# EAGLE design teemsyUp (EAGLE 9.1.3)
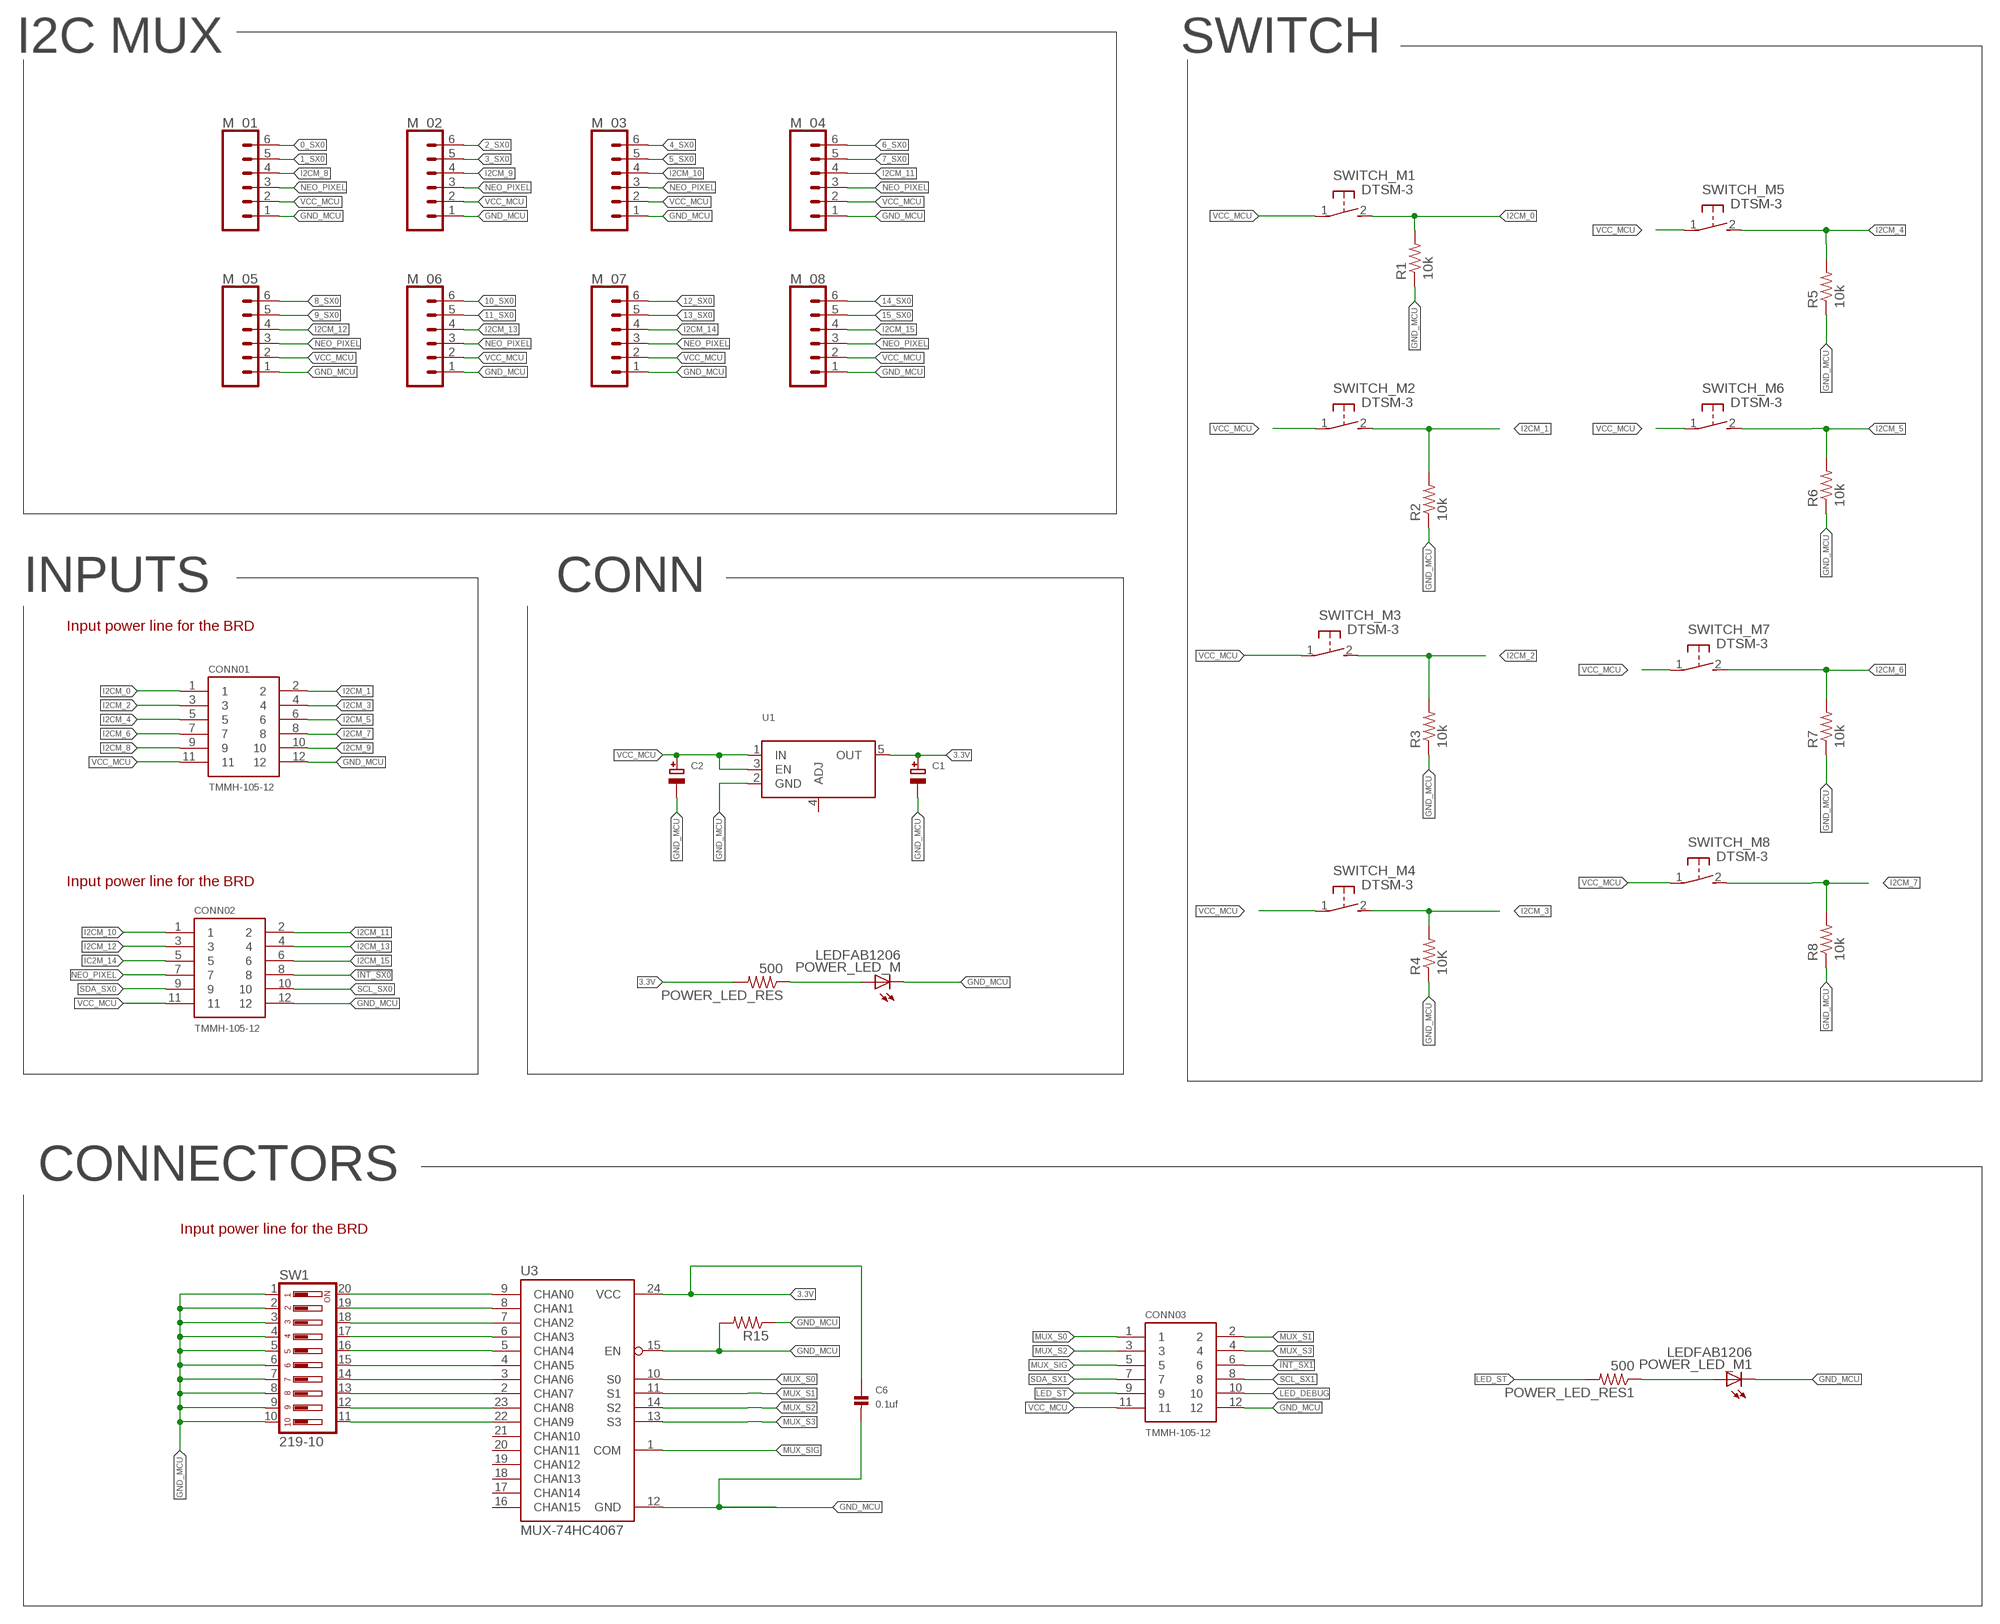
[diagram p0: schematic, sheet 1, part 1 of 2]
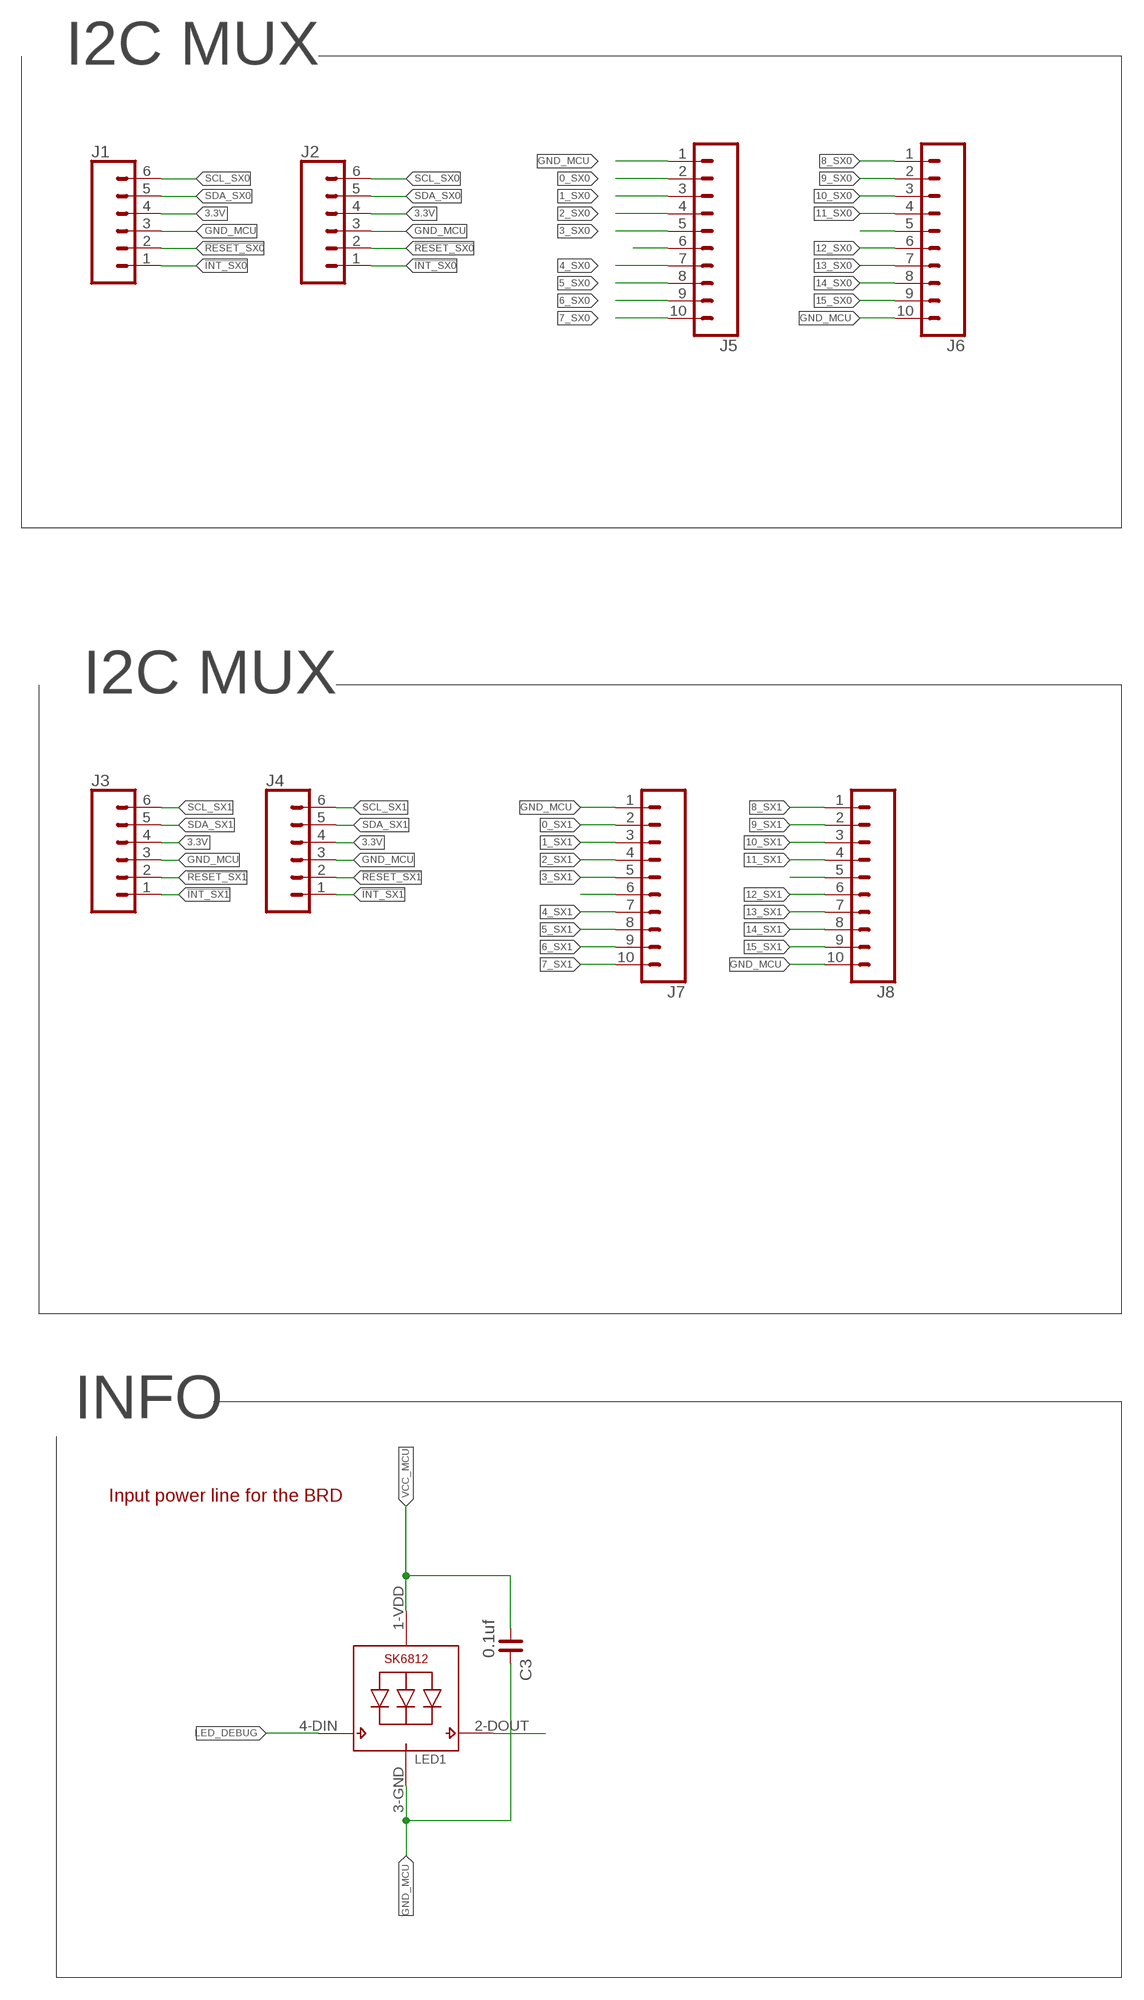
[diagram p1: schematic, sheet 1, part 2 of 2]

## Parts
C1  CAP_TANTALUMA/3216_REFLOW  [EIA3216-18/A-R]
C2  CAP_TANTALUMA/3216_REFLOW  [EIA3216-18/A-R]
C3  0.1uf  C_0805  [C0805]
C6  0.1uf  CAP_CERAMIC0805  [0805]
CONN01  TMMH-105-12  [TMMH-105-12]
CONN02  TMMH-105-12  [TMMH-105-12]
CONN03  TMMH-105-12  [TMMH-105-12]
J1  CONN_06SMD_MALE  [1X06_SMD_MALE]
J2  CONN_06SMD_MALE  [1X06_SMD_MALE]
J3  CONN_06SMD_MALE  [1X06_SMD_MALE]
J4  CONN_06SMD_MALE  [1X06_SMD_MALE]
J5  CONN_10SMD_MALE  [1X10_SMD_MALE]
J6  CONN_10SMD_MALE  [1X10_SMD_MALE]
J7  CONN_10SMD_MALE  [1X10_SMD_MALE]
J8  CONN_10SMD_MALE  [1X10_SMD_MALE]
LED1  SK6812_5050N  [LED5050_N]
M_01  CONN_06SMD-1MM  [1X06-1MM]
M_02  CONN_06SMD-1MM  [1X06-1MM]
M_03  CONN_06SMD-1MM  [1X06-1MM]
M_04  CONN_06SMD-1MM  [1X06-1MM]
M_05  CONN_06SMD-1MM  [1X06-1MM]
M_06  CONN_06SMD-1MM  [1X06-1MM]
M_07  CONN_06SMD-1MM  [1X06-1MM]
M_08  CONN_06SMD-1MM  [1X06-1MM]
POWER_LED_M  LEDFAB1206  [LED1206FAB]
POWER_LED_M1  LEDFAB1206  [LED1206FAB]
POWER_LED_RES  500  R-US_M0805  [M0805]
POWER_LED_RES1  500  R-US_R0805  [R0805]
R1  10k  R-US_M0805  [M0805]
R2  10k  R-US_M0805  [M0805]
R3  10k  R-US_M0805  [M0805]
R4  10K  R-US_M0805  [M0805]
R5  10k  R-US_M0805  [M0805]
R6  10k  R-US_M0805  [M0805]
R7  10k  R-US_M0805  [M0805]
R8  10k  R-US_M0805  [M0805]
R15  R-US_M0805  [M0805]
SW1  219-10  [CTS-219-10]
SWITCH_M1  DTSM-3  [DTSM-3]
SWITCH_M2  DTSM-3  [DTSM-3]
SWITCH_M3  DTSM-3  [DTSM-3]
SWITCH_M4  DTSM-3  [DTSM-3]
SWITCH_M5  DTSM-3  [DTSM-3]
SWITCH_M6  DTSM-3  [DTSM-3]
SWITCH_M7  DTSM-3  [DTSM-3]
SWITCH_M8  DTSM-3  [DTSM-3]
U1  ADP1712  [SOT23-5]
U3  MUX-74HC4067  MUX-74HC4067SMD  [SSOP24]

## Nets
0_SX0: J5.2 M_01.6
0_SX1: J7.2
1_SX0: J5.3 M_01.5
1_SX1: J7.3
2_SX0: J5.4 M_02.6
2_SX1: J7.4
3.3V: C1.+ C6.1 J1.4 J2.4 J3.4 J4.4 POWER_LED_RES.2 U1.5(OUT) U3.24(VCC)
3_SX0: J5.5 M_02.5
3_SX1: J7.5
4_SX0: J5.7 M_03.6
4_SX1: J7.7
5_SX0: J5.8 M_03.5
5_SX1: J7.8
6_SX0: J5.9 M_04.6
6_SX1: J7.9
7_SX0: J5.10 M_04.5
7_SX1: J7.10
8_SX0: J6.1 M_05.6
8_SX1: J8.1
9_SX0: J6.2 M_05.5
9_SX1: J8.2
10_SX0: J6.3 M_06.6
10_SX1: J8.3
11_SX0: J6.4 M_06.5
11_SX1: J8.4
12_SX0: J6.6 M_07.6
12_SX1: J8.6
13_SX0: J6.7 M_07.5
13_SX1: J8.7
14_SX0: J6.8 M_08.6
14_SX1: J8.8
15_SX0: J6.9 M_08.5
15_SX1: J8.9
!INT_SX0: CONN02.8 J1.1 J2.1
!INT_SX1: CONN03.6 J3.1 J4.1
!RESET_SX0: J1.2 J2.2
!RESET_SX1: J3.2 J4.2
C0: SW1.20 U3.9(CHAN0)
C1: SW1.19 U3.8(CHAN1)
C2: SW1.18 U3.7(CHAN2)
C3: SW1.17 U3.6(CHAN3)
C4: SW1.16 U3.5(CHAN4)
C5: SW1.15 U3.4(CHAN5)
C6: SW1.14 U3.3(CHAN6)
C7: SW1.13 U3.2(CHAN7)
C8: SW1.12 U3.23(CHAN8)
C9: SW1.11 U3.22(CHAN9)
GND_MCU: C1.- C2.- C3.2 C6.2 CONN01.12 CONN02.12 CONN03.12 J1.3 J2.3 J3.3 J4.3 J5.1 J6.10 J7.1 J8.10 LED1.3-GND(GND) M_01.1 M_02.1 M_03.1 M_04.1 M_05.1 M_06.1 M_07.1 M_08.1 POWER_LED_M1.2(C) POWER_LED_M.2(C) R1.1 R2.1 R3.1 R4.1 R5.1 R6.1 R7.1 R8.1 R15.1 R15.2 SW1.1 SW1.2 SW1.3 SW1.4 SW1.5 SW1.6 SW1.7 SW1.8 SW1.9 SW1.10 U1.2(GND) U3.12(GND) U3.15(EN)
I2CM_0: CONN01.1 R1.2 SWITCH_M1.2
I2CM_1: CONN01.2 R2.2 SWITCH_M2.2
I2CM_2: CONN01.3 R3.2 SWITCH_M3.2
I2CM_3: CONN01.4 R4.2 SWITCH_M4.2
I2CM_4: CONN01.5 R5.2 SWITCH_M5.2
I2CM_5: CONN01.6 R6.2 SWITCH_M6.2
I2CM_6: CONN01.7 R7.2 SWITCH_M7.2
I2CM_7: CONN01.8 R8.2 SWITCH_M8.2
I2CM_8: CONN01.9 M_01.4
I2CM_9: CONN01.10 M_02.4
I2CM_10: CONN02.1 M_03.4
I2CM_11: CONN02.2 M_04.4
I2CM_12: CONN02.3 M_05.4
I2CM_13: CONN02.4 M_06.4
I2CM_14: M_07.4
I2CM_15: CONN02.6 M_08.4
IC2M_14: CONN02.5
LED_DEBUG: CONN03.10 LED1.4-DIN(DI)
LED_ST: CONN03.9 POWER_LED_RES1.2
MUX_S0: CONN03.1 U3.10(S0)
MUX_S1: CONN03.2 U3.11(S1)
MUX_S2: CONN03.3 U3.14(S2)
MUX_S3: CONN03.4 U3.13(S3)
MUX_SIG: CONN03.5 U3.1(COM)
N$1: POWER_LED_M1.1(A) POWER_LED_RES1.1
N$11: POWER_LED_M.1(A) POWER_LED_RES.1
N$12: J5.6
N$13: LED1.2-DOUT(DO)
N$17: J7.6
N$18: J6.5
N$29: J8.5
NEO_PIXEL: CONN02.7 M_01.3 M_02.3 M_03.3 M_04.3 M_05.3 M_06.3 M_07.3 M_08.3
SCL_SX0: CONN02.10 J1.6 J2.6
SCL_SX1: CONN03.8 J3.6 J4.6
SDA_SX0: CONN02.9 J1.5 J2.5
SDA_SX1: CONN03.7 J3.5 J4.5
VCC_MCU: C2.+ C3.1 CONN01.11 CONN02.11 CONN03.11 LED1.1-VDD(VDD) M_01.2 M_02.2 M_03.2 M_04.2 M_05.2 M_06.2 M_07.2 M_08.2 SWITCH_M1.1 SWITCH_M2.1 SWITCH_M3.1 SWITCH_M4.1 SWITCH_M5.1 SWITCH_M6.1 SWITCH_M7.1 SWITCH_M8.1 U1.1(IN) U1.3(EN)
Unconnected: U1.4(ADJ) U3.16(CHAN15) U3.17(CHAN14) U3.18(CHAN13) U3.19(CHAN12) U3.20(CHAN11) U3.21(CHAN10)

## Notes on the sheet
- I2C MUX | SWITCH | I2C MUX
- I2C MUX
- INPUTS | CONN
- Input power line for the BRD
- Input power line for the BRD
- INFO
- CONNECTORS
- Input power line for the BRD
- Input power line for the BRD

## Library data of the parts
C1 C2 = microbuilder:CAP_TANTALUM: Tantalum Capacitors Wave footprints have larger pads and are meant to be used for hand soldering. Reflow footprints are optimised for solder paste and a reflow oven. EIA3216-18/A-[R/W] - Size A / 3216-18 / 1206 footprint 4.7µF 25V 10% Tantalum Capacitor 10µF 16V 10% Tantalum Capacitor [Digikey: 495-2236-2-ND] EIA3528-21/B-[R/W] - Size B / 3528-21 47µF 10V 10% Tantalum Capactior [Digikey: 495-2216-1-ND] EIA6032-28/C-[R/W] - Size C / 6032-28 10µF 35V 20% Tantalum Capacitor [Digikey: 495-2285-1-ND] 100µF 16V 10% Tantalum Capactior [Digikey: 399-5214-1-ND]
C3 = rc-master-smd:C_: NON-POLARIZED CAP
C6 = microbuilder:CAP_CERAMIC: Ceramic Capacitors 0402 - 0402 Surface Mount Capacitors 16pF 50V 5% [Digikey: 445-4899-2-ND] 18pF 50V 5% [Digikey: 490-1281-2-ND] 22pF 50V 5% [Digikey: 490-1283-2-ND] 68pF 50V 5% [Digikey: 490-1289-2-ND] 0.1uF 10V 10% [Digikey: 490-1318-2-ND] 1.0uF 6.3V 10% [Digikey: 490-1320-2-ND] 0603 - 0603 Surface Mount Capacitors 16 pF 50V 5% [Digikey: 445-5051-2-ND] 22 pF 50V [Digikey: PCC220ACVTR-ND] 33 pF 50V 5% [Digikey: 490-1415-1-ND] 56pF 50V 5% [Digikey: 490-1421-1-ND] 220pF 50V 5% [Digikey: 445-1285-1-ND] 680 pF 50V 2200 pF 50V 5% C0G [Digikey: 445-1297-1-ND] 5600 pF 100V 5% X7R [Digikey: 478-3711-1-ND] 0.1 µF 25V 10% [Digikey: PCC2277TR-ND] 0.22 µF 16V 10% X7R [Digikey: 445-1318-1-ND] 1.0 µF 25V 10% [Digikey: 445-5146-2-ND] 0603 - RF Specific 3pF 250V +/-0.1pF RF [Digikey: 712-1347-1-ND] 18 pF 250V 5% [Digikey: 478-3505-1-ND or 712-1322-1-ND] 56 pF 250V 5% C0G RF [Digikey: 490-4867-1-ND] 68 pF 250V RF [Digikey: 490-4868-1-ND] 0805 - 0805 Surface Mount Capacitors 220 pF 250V 2% RF Ceramic Capacitor [Digikey: 712-1398-1-ND] 1000 pF 50V 2% NP0 Ceramic Capacitor [Digikey: 478-3760-1-ND] 0.1 µF 25V 10% Ceramic Capacitor [Digikey: PCC1828TR-ND] 1.0 µF 16V 10% Ceramic Capacitor[Digikey: 490-1691-2-ND] 10.0 µF 10V 10% Ceramic Capacitor[Digikey: 709-1228-1-ND] 10.0 uF 16V 10% Ceramic Capacitor [Digikey: 478-5165-2-ND] 47 uF 6.3V 20% Ceramic Capacitor [Digikey: 587-1779-1-ND or 399-5506-1-ND] 1206 - 1206 Surface Mount Capacitors 47uF 10V 20% Ceramic Capacitor [Digikey: 490-5528-1-ND or 399-5508-1-ND or 445-6010-1-ND] 100uF 6.3V -20%, +80% Y5V Ceramic Capacitor (Digikey: 490-4512-1-ND, Mouser: 81-GRM31CF50J107ZE1L)
CONN01-CONN03 = TMMH-105-XX-XX-DV:TMMH-105-12: 2mm (.0787") Flex Shroud, .020" (.51mm) Square Post Terminal Strip, Surface Mount,10 Pins.
J1-J4 = SparkFun-Connectors:CONN_06: Multi connection point. Often used as Generic Header-pin footprint for 0.1 inch spaced/style header connections On any of the 0.1 inch spaced packages, you can populate with these: Break Away Headers - Straight <https://www.sparkfun.com/products/116> (PRT-00116) Break Away Male Headers - Right Angle <https://www.sparkfun.com/products/553> (PRT-00553) Female Headers <https://www.sparkfun.com/products/115> (PRT-00115) Break Away Headers - Machine Pin <https://www.sparkfun.com/products/117> (PRT-00117) Break Away Female Headers - Swiss Machine Pin <https://www.sparkfun.com/products/743> (PRT-00743) Arduino Stackable Header - 6 Pin <https://www.sparkfun.com/products/9280> (PRT-09280) For SCREWTERMINALS and SPRING TERMINALS visit here: Screw Terimnals on SparkFun.com <https://www.sparkfun.com/search/results?term=Screw+Terminals> (5mm/3.5mm/2.54mm spacing) This device is also useful as a general connection point to wire up your design to another part of your project. Our various solder wires solder well into these plated through hole pads. Hook-Up Wire - Assortment (Stranded, 22 AWG) <https://www.sparkfun.com/products/11375> (PRT-11375) Hook-Up Wire - Assortment (Solid Core, 22 AWG) <https://www.sparkfun.com/products/11367> (PRT-11367) View the entire wire category on our website here <https://www.sparkfun.com/categories/141>; PROD_ID: CONN-11293
J5-J8 = SparkFun-Connectors:CONN_10: Multi connection point. Often used as Generic Header-pin footprint for 0.1 inch spaced/style header connections On any of the 0.1 inch spaced packages, you can populate with these: Break Away Headers - Straight <https://www.sparkfun.com/products/116> (PRT-00116) Break Away Male Headers - Right Angle <https://www.sparkfun.com/products/553> (PRT-00553) Female Headers <https://www.sparkfun.com/products/115> (PRT-00115) Break Away Headers - Machine Pin <https://www.sparkfun.com/products/117> (PRT-00117) Break Away Female Headers - Swiss Machine Pin <https://www.sparkfun.com/products/743> (PRT-00743) Arduino Stackable Header - 10 Pin <https://www.sparkfun.com/products/11376> (PRT-11376) For SCREWTERMINALS and SPRING TERMINALS visit here: Screw Terimnals on SparkFun.com <https://www.sparkfun.com/search/results?term=Screw+Terminals> (5mm/3.5mm/2.54mm spacing) This device is also useful as a general connection point to wire up your design to another part of your project. Our various solder wires solder well into these plated through hole pads. Hook-Up Wire - Assortment (Stranded, 22 AWG) <https://www.sparkfun.com/products/11375> (PRT-11375) Hook-Up Wire - Assortment (Solid Core, 22 AWG) <https://www.sparkfun.com/products/11367> (PRT-11367) View the entire wire category on our website here <https://www.sparkfun.com/categories/141> Special notes: Molex polarized connector foot print use with SKU : PRT-08231 with associated crimp pins and housings. 1MM SMD Version SKU: PRT-10208 NOTES ON THE VARIANTS LOCK and LOCK_LONGPADS... This footprint was designed to help hold the alignment of a through-hole component (i.e. 6-pin header) while soldering it into place. You may notice that each hole has been shifted either up or down by 0.005 of an inch from it's more standard position (which is a perfectly straight line). This slight alteration caused the pins (the squares in the middle) to touch the edges of the holes. Because they are alternating, it causes a "brace" to hold the component in place. 0.005 has proven to be the perfect amount of "off-center" position when using our standard breakaway headers. Although looks a little odd when you look at the bare footprint, once you have a header in there, the alteration is very hard to notice. Also,if you push a header all the way into place, it is covered up entirely on the bottom side.; PROD_ID: CONN-11291
LED1 = SK6812:SK6812
M_01-M_08 = SparkFun-Connectors:CONN_06: Multi connection point. Often used as Generic Header-pin footprint for 0.1 inch spaced/style header connections On any of the 0.1 inch spaced packages, you can populate with these: Break Away Headers - Straight <https://www.sparkfun.com/products/116> (PRT-00116) Break Away Male Headers - Right Angle <https://www.sparkfun.com/products/553> (PRT-00553) Female Headers <https://www.sparkfun.com/products/115> (PRT-00115) Break Away Headers - Machine Pin <https://www.sparkfun.com/products/117> (PRT-00117) Break Away Female Headers - Swiss Machine Pin <https://www.sparkfun.com/products/743> (PRT-00743) Arduino Stackable Header - 6 Pin <https://www.sparkfun.com/products/9280> (PRT-09280) For SCREWTERMINALS and SPRING TERMINALS visit here: Screw Terimnals on SparkFun.com <https://www.sparkfun.com/search/results?term=Screw+Terminals> (5mm/3.5mm/2.54mm spacing) This device is also useful as a general connection point to wire up your design to another part of your project. Our various solder wires solder well into these plated through hole pads. Hook-Up Wire - Assortment (Stranded, 22 AWG) <https://www.sparkfun.com/products/11375> (PRT-11375) Hook-Up Wire - Assortment (Solid Core, 22 AWG) <https://www.sparkfun.com/products/11367> (PRT-11367) View the entire wire category on our website here <https://www.sparkfun.com/categories/141>; PROD_ID: CONN-08249; SF_ID: GPS-00579
POWER_LED_M POWER_LED_M1 = fab:LED: LED
POWER_LED_RES POWER_LED_RES1 R1-R8 R15 = resistor:R-US_: RESISTOR, American symbol
SW1 = switch-dil:219-10*: Surface Mount DIP Switch Series 219 SMT CTS Electronic Components Sourc: www.ctscorp.com; MF: SLI (CML/IDI); MPN: 219-10PK; OC_FARNELL: unknown; OC_NEWARK: 19M0224
SWITCH_M1-SWITCH_M8 = switch-tact:DTSM-3
U1 = microbuilder:ADP1712: LDO Adj. Voltage Regulator 300mA The ADP1712 voltage regulator is ideal for regulating battery or solar power due to it's very low foreward voltage drop (maximum 170mV at 300mA). Forward Voltage Dropout: 170mV at 300mA Input Voltage Range: 2.5V-5.5V Output Voltage Range: 0.8V-5.0V 1.2V - Digikey: ADP1712AUJZ-1.2-R7CT-ND 1.8V - Digikey: ADP1712AUJZ-1.8-R7CT-ND 3.3V - Digikey: ADP1712AUJZ-3.3-R7CT-ND
U3 = SparkFun:MUX-74HC4067

## Net classes
0 default: width 0.21 mm, clearance 0.12 mm

## Board
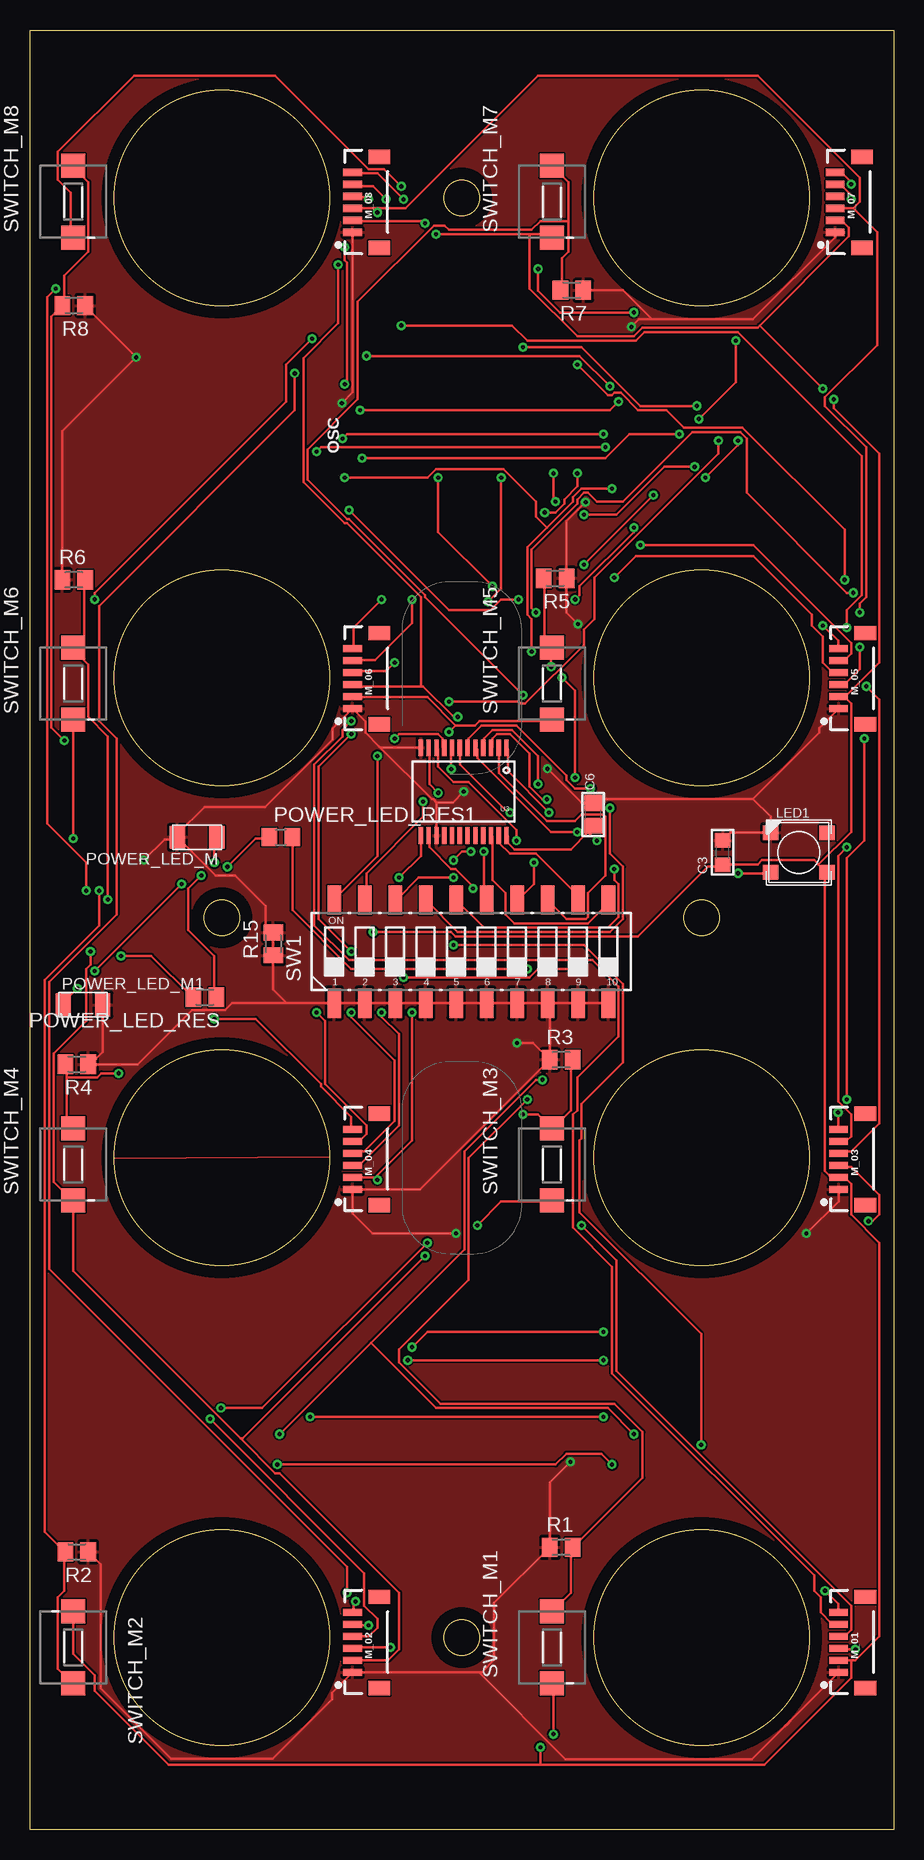
[diagram p2: board, top side]
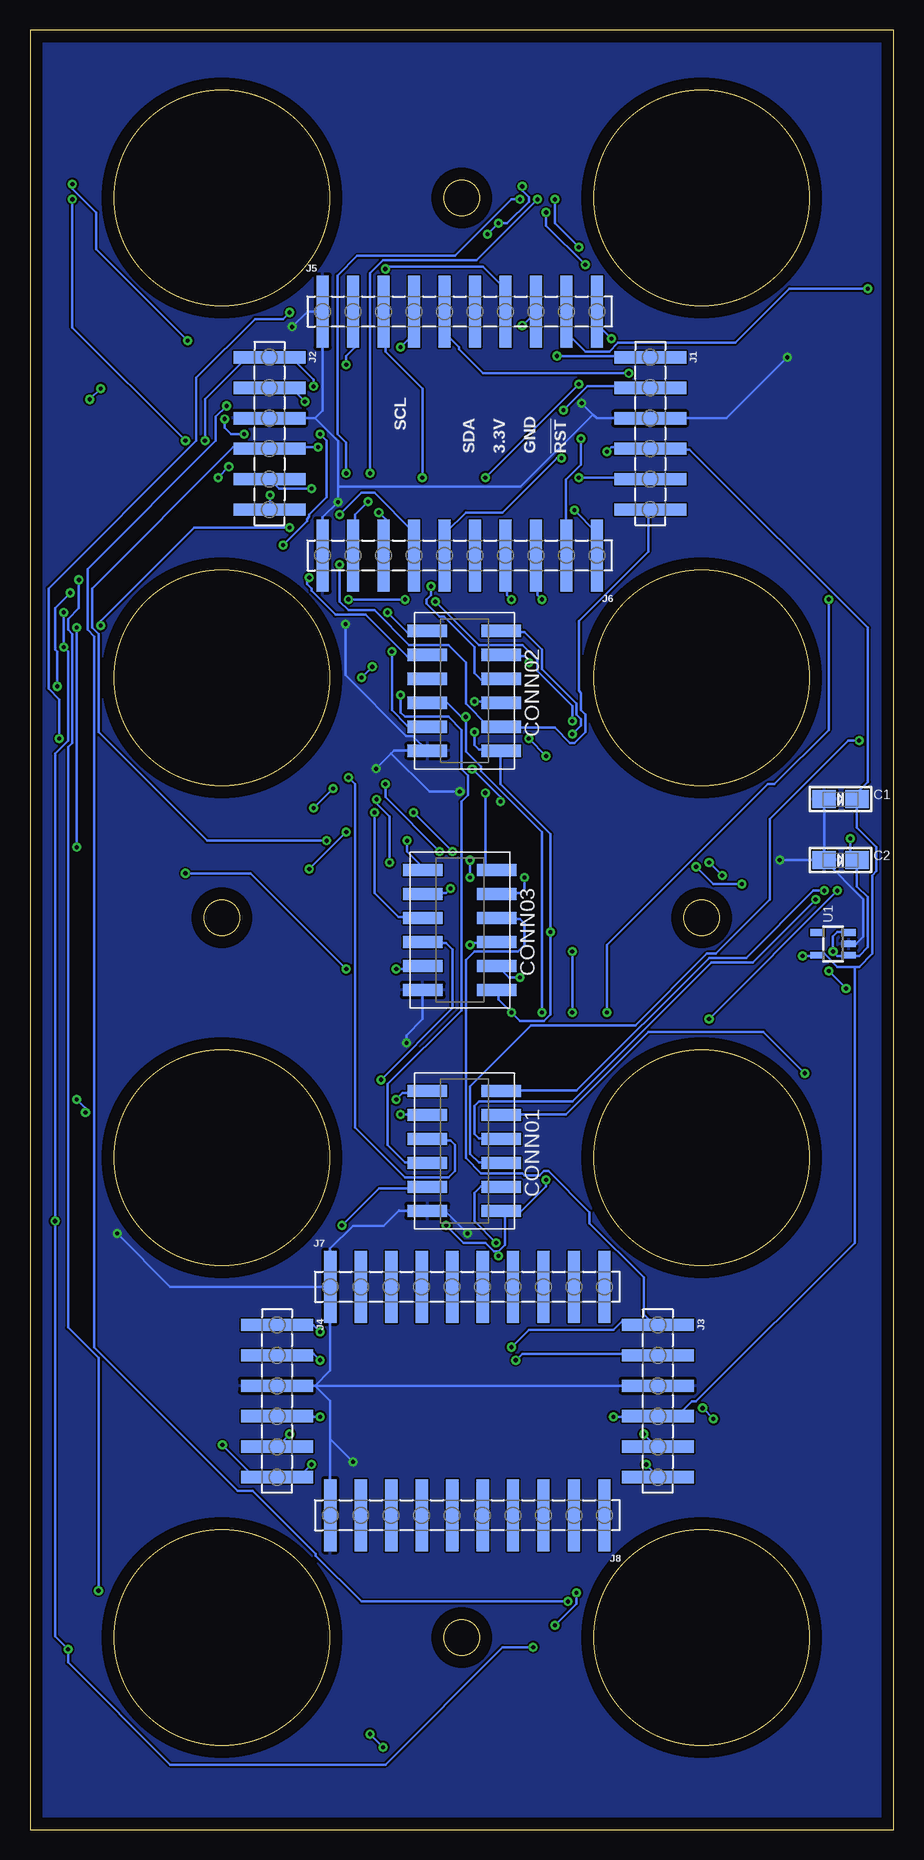
[diagram p3: board, bottom side, seen from below]

Size 72 x 150 mm. Coordinates in mm from the lower left corner, seen from the top.
Outline: 72,150 72,0 0,0 0,150 72,150
Outline: circle at 36,16 radius 1.5
Outline: circle at 16,76 radius 1.5
Outline: circle at 36,136 radius 1.5
Outline: circle at 56,76 radius 1.5
Outline: circle at 16,136 radius 9
Outline: circle at 56,136 radius 9
Outline: circle at 56,96 radius 9
Outline: circle at 56,56 radius 9
Outline: circle at 56,16 radius 9
Outline: circle at 16,16 radius 9
Outline: circle at 16,56 radius 9
Outline: circle at 16,96 radius 9
Copper layers (1*16): Top 0.035mm / dielectric 1.5mm / Bottom 0.035mm
Design rules "default": minimum track width 6mil, minimum drill 0.35mm, track to track 6mil, track to pad 6mil, pad to pad 6mil, via to via 6mil, smd to smd 6mil, copper to edge 40mil, drill to drill 6mil, minimum pad ring 10mil, minimum via ring 8mil, stop-mask expansion 4mil, vias tented up to drill 0mil, thermal gap 10mil

### Footprints (pad centres in the part's own frame; a part is rotated, then mirrored left to right if it is on the bottom)
EIA3216-18/A-R = smd 1.95 x 1.5: + 1.375,0; - -1.375,0
C0805 = smd 1.2 x 1.3: 1 -1.016,0; 2 1.016,0
0805 = smd 1.3 x 1.5: 1 -0.95,0; 2 0.95,0
TMMH-105-12 = smd 1.016 x 3.302: 1 -5.27,-3.086; 2 -5.27,3.086; 3 -3.27,-3.086; 4 -3.27,3.086; 5 -1.27,-3.086; 6 -1.27,3.086; 7 0.73,-3.086; 8 0.73,3.086; 9 2.73,-3.086; 10 2.73,3.086; 11 4.73,3.086; 12 4.73,-3.086
1X06_SMD_MALE = smd 1.02 x 6: 1 0,0; 2 2.54,0; 3 5.08,0; 4 7.62,0; 5 10.16,0; 6 12.7,0
1X10_SMD_MALE = smd 1.02 x 6: 1 0,0; 2 2.54,0; 3 5.08,0; 4 7.62,0; 5 10.16,0; 6 12.7,0; 7 15.24,0; 8 17.78,0; 9 20.32,0; 10 22.86,0
LED5050_N = smd 1.3 x 1.2: 1-VDD 2.35,-1.65; 2-DOUT 2.35,1.65; 3-GND -2.35,1.65; 4-DIN -2.35,-1.65
1X06-1MM = smd 0.6 x 1.55: 1 -2.54,1.27; 2 -1.54,1.27; 3 -0.54,1.27; 4 0.46,1.27; 5 1.46,1.27; 6 2.46,1.27 | smd 1.2 x 1.8: P$1 -3.84,-0.955; P$2 3.76,-0.955
LED1206FAB = smd 1.27 x 1.905: 1 -1.651,0; 2 1.651,0
M0805 = smd 1.3 x 1.6: 1 -0.95,0; 2 0.95,0
R0805 = smd 1.3 x 1.5: 1 -0.95,0; 2 0.95,0
CTS-219-10 = smd 1.13 x 2.44: 1 -11.43,-4.3; 2 -8.89,-4.3; 3 -6.35,-4.3; 4 -3.81,-4.3; 5 -1.27,-4.3; 6 1.27,-4.3; 7 3.81,-4.3; 8 6.35,-4.3; 9 8.89,-4.3; 10 11.43,-4.3; 11 11.43,4.3; 12 8.89,4.3; 13 6.35,4.3; 14 3.81,4.3; 15 1.27,4.3; 16 -1.27,4.3; 17 -3.81,4.3; 18 -6.35,4.3; 19 -8.89,4.3; 20 -11.43,4.3
DTSM-3 = smd 2 x 2: 1 -3,0; 2 3,0
SOT23-5 = smd 0.55 x 1.2: 1 -0.95,-1.3; 2 0,-1.3; 3 0.95,-1.3; 4 0.95,1.3; 5 -0.95,1.3
SSOP24 = smd 0.348 x 1.397: 1 -3.575,-3.656; 2 -2.925,-3.656; 3 -2.275,-3.656; 4 -1.625,-3.656; 5 -0.975,-3.656; 6 -0.325,-3.656; 7 0.325,-3.656; 8 0.975,-3.656; 9 1.625,-3.656; 10 2.275,-3.656; 11 2.925,-3.656; 12 3.575,-3.656; 13 3.575,3.656; 14 2.925,3.656; 15 2.275,3.656; 16 1.625,3.656; 17 0.975,3.656; 18 0.325,3.656; 19 -0.325,3.656; 20 -0.975,3.656; 21 -1.625,3.656; 22 -2.275,3.656; 23 -2.925,3.656; 24 -3.575,3.656

### Placement (x,y rotation side)
C1  4.42,85.88 0 bottom
C2  4.42,80.8 0 bottom
C3  57.75,81.44 90 top
C6  46.96,84.61 90 top
CONN01  35.78,56.29 270 bottom
CONN02  35.78,94.65 270 bottom
CONN03  36.16,74.71 270 bottom
J1  20.29,122.72 270 bottom
J2  52.04,122.72 270 bottom
J3  19.65,42.07 270 bottom
J4  51.41,42.07 270 bottom
J5  47.59,126.52 0 bottom
J6  24.73,106.2 180 bottom
J7  46.96,45.24 0 bottom
J8  24.1,26.2 180 bottom
LED1  64.11,81.44 0 top
M_01  68.69,15.64 90 top
M_02  28.16,15.64 90 top
M_03  68.69,55.9 90 top
M_04  28.16,55.9 90 top
M_05  68.69,95.97 90 top
M_06  28.16,95.97 90 top
M_07  68.41,135.67 90 top
M_08  28.16,135.67 90 top
POWER_LED_M  13.94,82.71 180 top
POWER_LED_M1  4.42,68.74 0 top
POWER_LED_RES  14.58,69.38 180 top
POWER_LED_RES1  20.92,82.71 0 top
R1  44.29,23.53 0 top
R2  3.91,23.15 180 top
R3  44.29,64.17 0 top
R4  3.91,63.79 180 top
R5  43.78,104.3 180 top
R6  3.65,104.17 0 top
R7  45.18,128.3 180 top
R8  3.65,127.03 180 top
R15  20.29,73.82 90 top
SW1  36.8,73.19 0 top
SWITCH_M1  43.53,15.19 90 top
SWITCH_M2  3.59,15.19 270 top
SWITCH_M3  43.53,55.45 90 top
SWITCH_M4  3.59,55.45 90 top
SWITCH_M5  43.53,95.52 90 top
SWITCH_M6  3.59,95.52 90 top
SWITCH_M7  43.53,135.67 90 top
SWITCH_M8  3.59,135.67 90 top
U1  5.05,73.82 90 bottom
U3  36.16,86.52 180 top

### Tracks (layer width: path | path; a pad name or v marks a point on that pad's centre or on a via)
0_SX0  (via drill 0.35)
  Top 0.21: v66.29,19.91 67.38,18.82 67.38,18.1 M_01.6 | v67.92,104.17 67.92,108.34 59.4,116.85 54.51,116.85 53.06,118.3 50.71,118.3 49.26,119.75 48.71,119.75 48.53,119.57 48.17,119.57 v45.63,122.11
  Bottom 0.21: v66.29,19.91 66.29,39.3 68.83,41.84 68.83,90.22 68.46,90.58 68.46,99.64 68.83,100 68.83,100.91 67.92,101.81 v67.92,104.17 | v45.63,122.11 45.63,122.83 44.91,123.56 44.91,126.46 J5.2
1_SX0  (via drill 0.35)
  Top 0.21: v26.79,92.39 26.06,91.67 26.06,91.12 23.71,88.77 23.71,75.36 26.61,72.46 46.9,72.46 49.07,70.28 49.07,66.12 45.63,62.67 45.63,59.96 45.27,59.59 45.27,50.17 48.53,46.91 48.53,38.03 65.38,21.18 65.38,19.91 65.93,19.37 65.93,18.1 66.83,17.19 67.38,17.19 M_01.5 | v38.2,102.36 39.29,103.44 v39.29,112.69
  Bottom 0.21: v26.79,92.39 26.79,93.66 29.69,96.56 29.69,97.46 30.95,98.73 34.58,98.73 v38.2,102.36 | v39.29,112.69 39.29,120.11 42.37,123.19 42.37,126.46 J5.3
2_SX0  (via drill 0.35)
  Top 0.21: v27.15,19 26.97,18.82 26.97,18.1 M_02.6 | v55.6,118.66 50.89,118.66 45.99,123.56 v41.1,123.56
  Bottom 0.21: v27.15,19 44.36,19 48.17,22.81 48.17,22.99 53.42,28.25 54.69,28.25 66.65,40.2 66.65,99.46 67.19,100 67.19,105.08 56.5,115.77 56.5,117.76 v55.6,118.66 | v41.1,123.56 40.02,124.64 40.02,126.46 J5.4
3.3V  (via drill 0.35)
  Top 0.21: 46.54,83.15 46.9,83.51 C6.1 46.54,83.15 | 46.54,83.15 45.09,81.7 40.38,81.7 39.83,82.24 39.83,82.79 U3.24 | v47.26,82.42 46.54,83.15 | v47.81,34.41 v23.34,34.41 | v7.58,72.82 10.12,72.82 13.56,69.38 POWER_LED_RES.2 | v47.99,115.22 24.25,115.22 v23.89,114.86
  Bottom 0.21: v47.26,82.42 57.23,82.42 66.29,91.48 66.29,99.64 66.83,100.18 66.83,103.44 55.05,115.22 52.16,115.22 J2.4 51.97,115.22 v47.99,115.22 | v23.34,34.41 19.72,34.41 J3.4 19.54,34.59 17.91,34.59 16.82,35.67 16.46,35.67 3.23,48.9 3.23,71.91 | v47.81,34.41 51.25,34.41 J4.4 | v7.58,72.82 6.49,72.82 U1.5 6.31,73 5.77,73 4.68,71.91 3.23,71.91 | 3.23,71.91 2.87,71.91 1.78,73 1.78,79.53 1.42,79.89 1.42,81.88 3.05,83.51 3.05,85.87 C1.+ 2.87,86.05 2.87,86.59 2.14,87.32 2.14,100.18 17,115.04 20.26,115.04 J1.4 20.45,115.22 23.53,115.22 v23.89,114.86
3_SX0  (via drill 0.35)
  Top 0.21: v28.24,17.01 26.97,17.01 M_02.5 | v26.42,19.73 26.42,21.9 1.6,46.73 1.6,70.65 7.22,76.26 7.22,90.94 5.77,92.39 5.77,101.99 22.08,118.3 v22.08,121.38
  Bottom 0.21: v28.24,17.01 26.42,18.82 v26.42,19.73 | v22.08,121.38 34.22,121.38 36.21,123.38 36.21,123.56 37.3,124.64 37.3,126.46 J5.5
4_SX0  (via drill 0.35)
  Top 0.21: v67.38,59.77 67.38,58.51 M_03.6 | v68.1,60.86 68.1,80.97 69.55,82.42 v69.55,90.94 | v50.34,126.46 44.18,126.46 42.37,128.27 v42.37,130.08
  Bottom 0.21: v67.38,59.77 67.38,60.14 v68.1,60.86 | v69.55,90.94 69.55,94.2 70.46,95.11 70.46,103.44 58.13,115.77 58.13,121.02 53.24,125.91 50.89,125.91 v50.34,126.46 | v42.37,130.08 42.19,130.26 34.22,130.26 32.41,128.45 32.41,126.64 J5.7
5_SX0  (via drill 0.35)
  Top 0.21: v68.1,81.88 67.38,81.16 67.38,60.68 68.46,59.59 68.46,57.78 68.1,57.42 67.56,57.42 M_03.5 | v68.1,100.18 68.1,101.63 69.37,102.9 69.37,114.5 59.04,124.83 51.25,124.83 50.52,124.1 41.46,124.1 40.2,125.37 v30.95,125.37
  Bottom 0.21: v68.1,100.18 v68.1,81.88 | v30.95,125.37 29.87,126.46 J5.8
6_SX0  (via drill 0.35)
  Top 0.21: v15.37,67.57 18.81,67.57 24.25,62.13 24.25,61.95 26.79,59.41 26.79,58.51 M_04.6 | v4.68,78.26 4.68,80.61 1.42,83.87 1.42,127.72 v2.14,128.45
  Bottom 0.21: v4.68,78.26 v15.37,67.57 | v2.14,128.45 8.67,128.45 13.2,123.92 22.98,123.92 23.71,123.19 25.7,123.19 27.15,124.64 27.15,126.46 J5.9
7_SX0  (via drill 0.35)
  Top 0.21: v23.89,68.11 24.61,67.38 24.61,62.13 28.06,58.69 28.06,57.96 27.51,57.42 26.97,57.42 M_04.5 | v5.41,102.54 5.41,103.08 21.35,119.03 21.35,122.11 v23.53,124.28
  Bottom 0.21: v23.89,68.11 23.89,73.73 10.48,87.14 9.94,87.14 5.41,91.67 v5.41,102.54 | v23.53,124.28 24.61,125.37 24.61,126.46 J5.10
8_SX0  (via drill 0.35)
  Top 0.21: v66.11,100.36 67.38,99.09 67.38,98.55 M_05.6 | v50.34,108.52 50.34,108.16 45.81,103.62 45.81,102.9 v45.45,102.54 | v40.74,102.54 39.29,102.54 38.38,101.63 34.94,101.63 v26.61,109.97
  Bottom 0.21: v66.11,100.36 66.11,100.73 58.32,108.52 v50.34,108.52 | v40.74,102.54 v45.45,102.54 | v26.61,109.97 24.79,108.16 24.79,106.34 J6.1
9_SX0  (via drill 0.35)
  Top 0.21: v50.89,107.07 60.31,107.07 68.46,98.91 68.46,98.01 67.92,97.46 67.56,97.46 M_05.5 | v47.81,116.31 26.42,116.31 v26.06,115.95
  Bottom 0.21: v50.89,107.07 48.89,109.06 48.89,109.24 48.71,109.42 48.71,109.6 47.26,111.05 47.26,115.77 v47.81,116.31 | v26.06,115.95 26.06,113.77 27.33,112.5 27.33,106.34 J6.2
10_SX0  (via drill 0.35)
  Top 0.21: v29.32,102.54 26.97,100.18 26.97,98.55 M_06.6
  Bottom 0.21: v29.32,102.54 29.69,102.9 29.69,106.16 J6.3
11_SX0  (via drill 0.35)
  Top 0.21: v31.86,102.54 31.86,100.55 28.78,97.46 26.97,97.46 M_06.5
  Bottom 0.21: v31.86,102.54 32.22,102.9 32.22,106.16 J6.4
12_SX0  (via drill 0.35)
  Top 0.21: v68.46,137.15 68.46,137.33 67.74,138.05 67.19,138.05 M_07.6 | v58.86,124.1 58.86,120.66 v55.78,117.58 | v54.15,116.31 49.98,116.31 47.99,114.32 v27.69,114.32
  Bottom 0.21: v68.46,137.15 68.46,136.78 66.47,134.79 66.47,131.71 v58.86,124.1 | v55.78,117.58 55.78,116.85 55.24,116.31 v54.15,116.31 | v27.69,114.32 28.06,114.32 32.59,109.79 35.67,109.79 37.3,108.16 37.3,106.34 J6.6
13_SX0  (via drill 0.35)
  Top 0.21: v68.46,135.88 68.46,136.24 67.74,136.97 67.19,136.97 M_07.5 | v59.04,115.77 59.04,115.4 v56.32,112.69 | v55.42,113.59 52.88,113.59 48.89,109.6 v46.18,109.6
  Bottom 0.21: v68.46,135.88 68.46,125.19 v59.04,115.77 | v55.42,113.59 v56.32,112.69 | v46.18,109.6 44.36,111.42 43.28,111.42 40.02,108.16 40.02,106.34 J6.7
14_SX0  (via drill 0.35)
  Top 0.21: v31.14,135.88 28.96,138.05 26.97,138.05 M_08.6 | v45.63,113.05 45.63,111.96 44.55,110.87 44.55,110.51 43.82,109.79 v42.91,109.79
  Bottom 0.21: v31.14,135.88 31.86,135.88 36.57,131.17 44.73,131.17 46.36,129.54 46.36,116.31 45.63,115.58 v45.63,113.05 | v42.91,109.79 42.37,109.24 42.37,106.34 J6.8
15_SX0  (via drill 0.35)
  Top 0.21: v29.69,135.88 28.6,136.97 26.97,136.97 M_08.5 | v43.64,113.05 43.64,110.87 v43.82,110.69
  Bottom 0.21: v29.69,135.88 34.76,130.81 42.55,130.81 43.64,129.72 v43.64,113.05 | v43.82,110.69 44.91,109.6 44.91,106.34 J6.9
!INT_SX0  (via drill 0.35)
  Top 0.21: v34.94,94.02 40.74,94.02 40.92,93.84 41.28,93.84 46.18,98.73 46.18,100 47.08,100.91 47.08,104.35 57.41,114.68 v57.41,115.77 | v28.06,122.83 45.81,122.83 v48.35,120.3
  Bottom 0.21: v34.94,94.02 32.77,94.02 CONN02.8 | v57.41,115.77 57.41,119.21 53.97,122.65 52.16,122.65 J2.1 51.97,122.65 50.16,122.65 48.35,120.84 v48.35,120.3 | v28.06,122.83 20.45,122.83 J1.1
!INT_SX1  (via drill 0.35)
  Top 0.21: v47.81,41.47 33.13,41.47 v31.86,40.2
  Bottom 0.21: 20.26,42.38 20.08,42.2 19.72,42.2 J3.1 20.26,42.38 | 20.26,42.38 20.81,42.92 20.81,46 25.34,50.53 25.34,51.44 28.78,54.88 29.14,54.88 29.51,54.52 30.77,54.52 30.95,54.7 34.4,54.7 35.67,55.97 35.67,72.46 34.94,73.18 31.32,73.18 30.77,73.73 30.77,75.54 31.14,75.9 32.95,75.9 CONN03.6 | v47.81,41.47 48.35,42.02 51.25,42.02 J4.1 | v31.86,40.2 30.41,41.65 23.34,41.65 22.62,42.38 20.26,42.38
!RESET_SX0  (via drill 0.35)
  Top 0.21: v27.51,118.3 48.35,118.3 v49.07,119.03
  Bottom 0.21: v27.51,118.3 25.52,120.3 20.45,120.3 J1.2 | v49.07,119.03 50.16,120.11 51.97,120.11 J2.2
!RESET_SX1  (via drill 0.35)
  Top 0.21: v47.81,39.12 v31.5,39.12
  Bottom 0.21: v31.5,39.12 30.95,39.66 19.72,39.66 J3.2 | v47.81,39.12 48.35,39.66 51.25,39.66 J4.2
C0  (via drill 0.35)
  Top 0.21: v30.41,90.94 30.77,91.3 34.04,91.3 34.4,90.94 34.4,90.22 U3.9 | v28.96,89.49 28.96,81.16 25.34,77.53 SW1.20
  Bottom 0.21: v28.96,89.49 v30.41,90.94
C1  (via drill 0.35)
  Top 0.21: v35.12,88.4 35.12,90.03 U3.8 | v32.77,85.69 32.77,84.42 28.06,79.71 28.06,77.53 SW1.19
  Bottom 0.21: v35.12,88.4 32.77,86.05 v32.77,85.69
C2  (via drill 0.35)
  Top 0.21: v40.02,84.78 39.83,84.78 35.85,88.77 35.85,90.03 U3.7 | v36.75,81.52 36.03,81.52 v35.3,80.79 | v35.3,79.34 32.41,79.34 30.59,77.53 SW1.18
  Bottom 0.21: v36.75,81.52 v40.02,84.78 | v35.3,79.34 v35.3,80.79
C3  (via drill 0.35)
  Top 0.21: v46.72,86.77 45.45,86.77 44.73,87.5 44.73,87.86 40.56,92.03 37.66,92.03 36.57,90.94 36.57,90.22 U3.6 | v48.35,85.14 48.35,81.34 49.44,80.25 49.44,75.9 48.35,74.81 35.67,74.81 33.13,77.35 SW1.17
  Bottom 0.21: v48.35,85.14 v46.72,86.77
C4  (via drill 0.35)
  Top 0.21: v45.63,83.15 43.46,83.15 37.3,89.31 37.3,90.03 U3.5 | v48.71,80.07 48.71,79.16 49.07,78.8 49.07,76.08 48.17,75.18 37.84,75.18 35.67,77.35 SW1.16
  Bottom 0.21: v48.71,80.07 v45.63,83.15
C5  (via drill 0.35)
  Top 0.21: v42.37,87.14 42.37,89.49 40.2,91.67 38.57,91.67 37.84,90.94 37.84,90.22 U3.4 | v37.84,81.52 37.84,77.71 38.02,77.53 SW1.15
  Bottom 0.21: v42.37,87.14 42.37,86.05 v37.84,81.52
C6  (via drill 0.35)
  Top 0.21: v43.1,85.87 42.73,85.87 41.65,86.95 41.65,89.67 40.02,91.3 38.93,91.3 38.57,90.94 38.57,90.22 U3.3 | v42.01,80.61 42.01,78.8 40.74,77.53 SW1.14
  Bottom 0.21: v43.1,85.87 43.1,85.5 42.01,84.42 v42.01,80.61
C7
  Top 0.21: U3.2 39.11,90.03 39.11,88.04 43.1,84.06 45.45,84.06 45.99,84.6 47.81,84.6 47.99,84.42 47.99,79.53 46.54,78.08 46.54,76.08 46.36,75.9 44.73,75.9 43.28,77.35 SW1.13
C8
  Top 0.21: U3.23 39.11,82.79 39.11,82.24 40.02,81.34 42.19,81.34 45.63,77.89 45.63,77.53 SW1.12
C9
  Top 0.21: U3.22 38.57,82.79 38.57,79.16 39.65,78.08 39.65,76.26 40.38,75.54 46.54,75.54 48.35,77.35 SW1.11
GND_MCU  (via drill 0.35)
  Top 0.2: 37.44,13.1 37.67,13.1 38.7,14.13 38.7,18.89 R1.1 43.34,28.93 v45.05,30.64 | 37.44,13.1 M_02.1 25.21,11.41 25.21,10.84 20.25,5.88 11.75,5.88 5.88,11.75 5.88,22.12 R2.1 | M_08.1 26.89,119.79 v26,118.91 | R8.1 4.6,126.97 v8.86,122.72 2.7,116.56 R6.1 | 12.48,82.52 14.7,80.3 15.46,79.53 17.11,79.53 19.65,76.99 19.65,75.41 R15.2 R15.1 20.29,70.01 21.41,68.88 21.56,68.88 | 12.48,82.52 POWER_LED_M.2 12.29,82.96 14.58,85.25 19.62,85.25 25.23,90.86 25.23,91.76 M_06.1 27.97,92.35 27.97,91.42 29.12,90.27 | 21.56,68.88 SW1.1 SW1.2 SW1.3 SW1.4 SW1.5 SW1.6 SW1.7 SW1.8 | SW1.8 SW1.9 SW1.10 | SW1.8 43.34,68.69 R3.1 | M_01.1 63.4,9.08 63.18,8.82 62.92,8.6 60.2,5.88 44.66,5.88 37.44,13.1 | v35.53,49.69 28.54,49.69 26.89,51.34 M_04.1 32.53,53.36 R3.1 | v64.74,49.69 67.42,52.37 M_03.1 | 29.12,90.27 29.21,90.18 U3.12 | M_05.1 65.81,91.81 65.81,91.45 60.27,85.91 | 60.27,85.91 60.25,85.88 47.27,85.88 C6.2 46.01,85.56 v43.15,88.42 | v45.69,100.49 44.73,101.44 R5.1 44.73,109.06 45.69,110.02 v46.32,110.65 | R7.1 49.43,128.3 51.85,125.88 52.04,125.88 | 52.04,125.88 60.28,125.88 67.14,132.73 M_07.1 | 52.04,125.88 50.76,125.88 v50.13,125.25 | 29.12,90.27 33.5,85.88 33.62,85.88 33.89,85.62 | 33.89,85.62 33.89,85.25 U3.15 | 33.89,85.62 35.27,85.62 v36.16,86.52 | v9.5,80.8 11.21,82.52 12.48,82.52 | 21.56,68.88 16.84,68.88 16.28,68.32 13.52,68.32 8.99,63.79 5.05,63.79 | 5.05,63.79 R4.1 | R3.1 41.95,65.56 v40.61,65.56 | 60.27,85.91 61.75,84.42 LED1.3-GND 58.39,83.09 C3.2 | POWER_LED_M1.2 6.07,64.8 5.05,63.79
  Bottom 0.2: v26,118.91 25.05,117.95 | 25.05,117.95 24.73,117.63 J1.3 13.94,117.63 v8.86,122.72 | v35.53,49.69 37.4,51.56 CONN01.12 41.21,51.56 41.24,51.59 42.52,50.32 45.05,50.32 46.96,48.42 J7.1 | J7.1 60.3,45.24 v64.74,49.69 | 46.96,32.54 46.96,35.72 48.23,36.99 | 46.96,32.54 J8.10 | J4.3 48.23,36.99 | J7.1 46.96,38.26 48.23,36.99 | v45.05,30.64 46.96,32.54 | v43.15,88.42 41.88,89.69 | 41.88,89.69 41.66,89.92 CONN02.12 40.11,91.16 40.63,91.16 45.69,96.22 v45.69,100.49 | J6.10 47.59,109.38 v46.32,110.65 46.32,111.92 | 46.32,111.92 46.32,115.73 48.23,117.63 | 48.23,117.63 J2.3 | 48.23,117.63 47.59,118.27 J5.1 48.87,126.52 v50.13,125.25 | 46.32,111.92 31.08,111.92 25.05,117.95 | 41.88,89.69 38.7,86.52 v36.16,86.52 | C1.- C2.- | C2.- 2.51,77.52 2.51,74.45 3.15,73.82 U1.2 | C2.- v9.5,80.8 | v40.61,65.56 40.61,66.2 39.25,67.56 CONN03.12 | J3.3 48.23,36.99
  pour Top: -20.98,163.35 83.16,163.35 83.16,-6.83 -20.98,-6.83
  pour Bottom: -4.48,153.19 74.27,153.19 74.27,-3.01 -4.48,-3.01
I2CM_0  (via drill 0.35)
  Top 0.21: SWITCH_M1.2 43.64,18.28 45.09,19.73 45.09,23.35 R1.2 45.27,23.54 51.07,29.33 51.07,33.14 48.71,35.49 34.22,35.49 30.77,38.94 30.77,40.02 36.57,45.82 36.57,55.97 v41.46,60.86
  Bottom 0.21: v41.46,60.86 40.92,61.41 38.93,61.41 CONN01.1
I2CM_1  (via drill 0.35)
  Top 0.21: SWITCH_M2.2 3.41,12.3 2.33,13.39 2.33,19.37 2.87,19.91 2.87,22.99 R2.2 2.87,23.17 1.24,24.8 1.24,70.83 5.77,75.36 v5.77,78.26
  Bottom 0.21: v5.77,78.26 6.67,78.26 12.29,72.64 15.37,72.64 26.42,61.59 32.59,61.59 CONN01.2
I2CM_2  (via drill 0.35)
  Top 0.21: R3.2 45.09,64.12 45.09,59.96 43.64,58.51 SWITCH_M3.2 43.46,58.51 42.37,59.59 v41.1,59.59
  Bottom 0.21: v41.1,59.59 38.93,59.59 CONN01.3
I2CM_3  (via drill 0.35)
  Top 0.21: 3.05,62.67 3.05,58.87 3.41,58.51 SWITCH_M4.2 | 3.05,62.67 3.05,63.76 R4.2 | v7.4,63.04 5.95,63.04 5.59,62.67 3.05,62.67
  Bottom 0.21: v7.4,63.04 10.84,66.48 20.45,66.48 27.33,59.59 32.59,59.59 CONN01.4
I2CM_4  (via drill 0.35)
  Top 0.21: R5.2 42.91,104.17 42.91,99.09 43.46,98.55 SWITCH_M5.2 43.46,98.37 v43.46,96.92 | v45.45,87.68 45.45,94.93 v44.36,96.02
  Bottom 0.21: v45.45,87.68 44.91,87.14 44.91,58.51 40.74,54.34 37.12,54.34 36.57,54.88 36.57,57.06 36.94,57.42 38.75,57.42 CONN01.5 | v43.46,96.92 v44.36,96.02
I2CM_5  (via drill 0.35)
  Top 0.21: R6.2 4.5,104.17 4.5,99.46 3.59,98.55 SWITCH_M6.2 3.59,98.37 4.86,97.1 4.86,92.75 6.49,91.12 v6.49,77.53
  Bottom 0.21: v6.49,77.53 11.75,72.28 15.19,72.28 26.79,60.68 34.58,60.68 34.94,60.32 34.94,57.96 34.58,57.6 32.77,57.6 CONN01.6
I2CM_6  (via drill 0.35)
  Top 0.21: 44.91,134.07 44.91,137.33 43.64,138.6 SWITCH_M7.2 | 44.91,134.07 44.91,131.53 44.36,130.99 44.36,128.45 R7.2 | v41.1,94.56 32.95,102.72 32.95,102.9 26.61,109.24 26.42,109.24 23.16,112.5 23.16,115.04 27.33,119.21 27.33,127.36 33.67,133.7 34.58,133.7 34.94,133.34 41.83,133.34 42.55,134.07 44.91,134.07
  Bottom 0.21: v41.1,94.56 41.1,93.12 40.74,92.75 37.12,92.75 36.03,91.67 36.03,88.4 35.48,87.86 35.48,86.23 36.03,85.69 36.03,68.29 42.19,62.13 42.19,57.06 40.74,55.61 38.93,55.61 CONN01.7
I2CM_7  (via drill 0.35)
  Top 0.21: SWITCH_M8.2 3.59,138.6 4.86,137.33 4.86,131.53 2.87,129.54 2.87,127.18 R8.2 2.69,127 1.78,126.09 1.78,91.85 v2.87,90.76
  Bottom 0.21: v2.87,90.76 3.78,90.76 10.3,84.24 10.3,77.53 14.83,73 15.55,73 21.53,67.02 30.23,67.02 35.3,61.95 35.3,56.33 34.58,55.61 32.77,55.61 CONN01.8
I2CM_8  (via drill 0.35)
  Top 0.21: v45.99,50.35 48.89,47.45 48.89,38.21 68.46,18.64 68.46,16.65 67.92,16.11 67.56,16.11 M_01.4
  Bottom 0.21: v45.99,50.35 42.91,53.43 38.93,53.43 CONN01.9
I2CM_9  (via drill 0.35)
  Top 0.21: v15.01,34.23 27.88,21.36 27.88,18.64 28.96,17.55 28.96,16.83 28.24,16.11 26.97,16.11 M_02.4 | v15.92,35.13 19.36,35.13 v33.13,48.9
  Bottom 0.21: v15.92,35.13 v15.01,34.23 | v33.13,48.9 34.94,50.71 34.94,53.07 34.4,53.61 32.77,53.61 CONN01.10
I2CM_10  (via drill 0.35)
  Top 0.21: v69.73,95.29 70.82,94.2 70.82,58.87 68.46,56.51 67.56,56.51 M_03.4 | v68.64,103.08 68.1,103.08 59.77,111.42 59.77,115.95 59.22,116.49 55.24,116.49 49.44,110.69 47.26,110.69 46.54,111.42 46.18,111.42 45.63,110.87 45.63,110.51 41.83,106.71 41.83,101.81 v42.19,101.45
  Bottom 0.21: v69.73,95.29 69.73,98.19 69.91,98.37 69.91,101.81 v68.64,103.08 | v42.19,101.45 40.56,99.82 38.93,99.82 CONN02.1
I2CM_11  (via drill 0.35)
  Top 0.21: v26.79,68.11 26.79,67.75 30.41,64.12 30.41,59.05 27.88,56.51 26.97,56.51 M_04.4 | v26.79,73.18 24.07,75.9 24.07,88.59 v26.79,91.3
  Bottom 0.21: v26.79,73.18 v26.79,68.11 | v26.79,91.3 26.06,92.03 26.06,92.57 26.42,92.93 26.42,93.84 29.32,96.74 29.32,98.37 30.77,99.82 32.59,99.82 CONN02.2
I2CM_12  (via drill 0.35)
  Top 0.21: v48.71,104.35 50.52,106.16 60.31,106.16 65.2,101.27 65.2,100.36 66.11,99.46 66.11,97.28 66.83,96.56 67.38,96.56 M_05.4
  Bottom 0.21: v48.71,104.35 48.89,104.17 48.89,103.81 48.53,103.44 48.53,103.26 46.54,101.27 44,101.27 40.56,97.83 38.93,97.83 CONN02.3
I2CM_13  (via drill 0.35)
  Top 0.21: v30.41,97.28 29.69,96.56 26.97,96.56 M_06.4
  Bottom 0.21: v30.41,97.28 30.41,97.46 30.77,97.83 32.59,97.83 CONN02.4
I2CM_15  (via drill 0.35)
  Top 0.21: v28.24,135.88 28.06,136.06 26.97,136.06 M_08.4 | v26.24,131.89 26.24,130.81 26.42,130.62 26.42,120.66 v26.24,120.48 | v34.04,112.69 34.04,108.16 v38.57,103.62
  Bottom 0.21: v28.24,135.88 28.24,133.89 v26.24,131.89 | v34.04,112.69 v26.24,120.48 | v38.57,103.62 38.57,102.9 38.93,102.54 38.93,102.18 37.84,101.09 37.48,101.09 34.94,98.55 34.94,96.38 34.4,95.83 32.77,95.83 CONN02.6
LED_DEBUG  (via drill 0.35)
  Top 0.21: v59.04,79.71 61.58,79.71 LED1.4-DIN | v45.63,71.73 42.37,71.73 41.65,71.01 v31.14,71.01
  Bottom 0.21: v59.04,79.71 53.6,79.71 v45.63,71.73 | v31.14,71.01 32.04,71.01 32.95,71.91 CONN03.10
LED_ST  (via drill 0.35)
  Top 0.21: v41.46,71.73 26.79,71.73 21.89,76.63 21.89,82.61 POWER_LED_RES1.2
  Bottom 0.21: v41.46,71.73 39.47,71.73 39.29,71.91 CONN03.9
MUX_S0  (via drill 0.35)
  Top 0.21: v40.56,82.42 40.56,83.33 36.57,87.32 35.3,87.32 34.04,88.59 34.04,90.03 U3.10
  Bottom 0.21: v40.56,82.42 40.56,81.52 39.11,80.07 CONN03.1
MUX_S1  (via drill 0.35)
  Top 0.21: v34.04,86.41 33.31,87.14 33.31,90.03 U3.11
  Bottom 0.21: v34.04,86.41 34.04,80.43 33.67,80.07 33.13,80.07 CONN03.2
MUX_S2  (via drill 0.35)
  Top 0.21: v36.94,78.44 36.94,78.62 35.48,80.07 35.12,80.07 33.31,81.88 33.31,82.79 U3.14
  Bottom 0.21: v36.94,78.44 37.3,78.08 39.11,78.08 CONN03.3
MUX_S3  (via drill 0.35)
  Top 0.21: v30.77,79.34 32.59,81.16 32.59,82.79 U3.13
  Bottom 0.21: v30.77,79.34 30.77,78.44 31.14,78.08 32.95,78.08 CONN03.4
MUX_SIG  (via drill 0.35)
  Top 0.21: v43.28,84.78 39.83,88.22 39.83,90.03 U3.1
  Bottom 0.21: v43.28,84.78 43.28,78.08 41.28,76.08 39.29,76.08 CONN03.5
N$1  (via drill 0.35)
  Top 0.21: v16.46,80.25 18.81,82.61 19.9,82.61 POWER_LED_RES1.1 | v5.41,71.55 v12.65,78.8 | v3.96,70.1 2.69,68.83 POWER_LED_M1.1
  Bottom 0.21: v16.46,80.25 15.01,78.8 v12.65,78.8 | v3.96,70.1 v5.41,71.55
N$11  (via drill 0.35)
  Top 0.21: v14.29,79.53 13.2,78.44 13.2,75 15.37,72.82 15.37,69.38 POWER_LED_RES.1 | v15.37,80.61 15.37,82.42 15.55,82.61 POWER_LED_M.1
  Bottom 0.21: v15.37,80.61 v14.29,79.53
NEO_PIXEL  (via drill 0.35)
  Top 0.21: v30.05,15.2 26.97,15.2 M_02.3 | v68.83,15.02 67.56,15.02 M_01.3 | v69.91,50.71 70.28,50.71 70.82,51.26 70.82,52.89 68.46,55.24 67.56,55.24 M_03.3 | v29.32,68.11 29.32,67.75 30.77,66.3 30.77,58.69 27.51,55.43 26.97,55.43 M_04.3 | 32.59,95.29 32.77,95.29 35.3,92.75 v35.67,92.75 | 32.59,95.29 26.97,95.29 M_06.3 | 28.96,135.15 31.32,135.15 42.37,146.21 60.67,146.21 69.19,137.69 69.19,135.7 68.64,135.15 | 28.96,135.15 26.97,135.15 M_08.3 | 68.64,135.15 67.19,135.15 M_07.3 | v69.19,98.55 69.19,96.74 67.92,95.47 67.56,95.47 M_05.3 | v69.19,101.45 69.19,102.18 69.73,102.72 69.73,115.22 66.29,118.66 66.29,119.39 70.64,123.74 70.64,133.16 68.64,135.15 | 32.59,95.29 32.59,102.72 26.42,108.88 26.24,108.88 22.8,112.32 22.8,122.65 25.7,125.55 v25.7,130.44 | 28.96,135.15 v28.96,134.79
  Bottom 0.21: v30.05,15.2 32.59,15.2 42.37,5.42 60.31,5.42 68.83,13.93 v68.83,15.02 69.91,16.11 v69.91,50.71 69.91,89.67 68.83,90.76 68.83,98.19 v69.19,98.55 v69.19,101.45 | v29.32,68.11 29.32,83.15 34.4,88.22 34.4,88.59 35.67,89.85 35.67,92.39 35.85,92.57 | 35.85,92.57 37.3,94.02 38.75,94.02 CONN02.7 | 35.85,92.57 v35.67,92.75 | v25.7,130.44 28.96,133.7 v28.96,134.79
SCL_SX0  (via drill 0.35)
  Top 0.21: v46.18,105.44 v51.97,111.24
  Bottom 0.21: J1.6 20.45,109.97 20.45,106.52 26.24,100.73 26.24,94.93 26.06,94.75 26.06,93.3 25.7,92.93 25.7,91.48 26.61,90.58 26.97,90.58 28.24,91.85 32.59,91.85 CONN02.10 32.77,92.03 33.85,92.03 35.67,93.84 35.67,97.28 37.12,98.73 40.38,98.73 43.28,101.63 45.45,101.63 46.18,102.36 v46.18,105.44 | v51.97,111.24 51.97,110.15 J2.6
SCL_SX1  (via drill 0.35)
  Top 0.21: v35.3,73.73 46.18,73.73 49.44,70.47 49.44,63.94 45.99,60.5 45.99,57.6 45.81,57.42 45.81,51.44 55.96,41.29 v55.96,32.05 | v20.63,30.42 43.82,30.42 44.73,31.33 47.63,31.33 v48.53,30.42
  Bottom 0.21: v35.3,73.73 35.12,73.91 33.13,73.91 CONN03.8 | v55.96,32.05 53.42,29.51 51.43,29.51 J4.6 51.25,29.51 49.44,29.51 v48.53,30.42 | v20.63,30.42 19.72,29.51 J3.6
SDA_SX0  (via drill 0.35)
  Top 0.21: v41.83,98.19 41.83,100.91 41.46,101.27 41.46,106.89 43.1,108.52 | 43.1,108.52 45.27,110.69 45.27,111.05 45.99,111.78 v48.53,111.78 | v26.24,112.69 33.13,112.69 33.85,113.41 39.47,113.41 42.19,110.69 42.19,109.42 43.1,108.52
  Bottom 0.21: v41.83,98.19 41.83,93.3 40.56,92.03 38.93,92.03 CONN02.9 | v48.53,111.78 51.25,111.78 51.97,112.5 J2.5 | v26.24,112.69 20.45,112.69 J1.5
SDA_SX1  (via drill 0.35)
  Top 0.21: v42.73,62.49 42.19,62.49 36.21,56.51 36.21,48.36 28.42,40.57 | v20.81,32.96 28.42,40.57 | v50.34,32.96 48.17,35.13 33.85,35.13 28.42,40.57
  Bottom 0.21: v42.73,62.49 36.75,68.47 36.75,73.36 37.3,73.91 39.11,73.91 CONN03.7 | v20.81,32.96 19.72,31.87 J3.5 | v50.34,32.96 51.25,32.05 J4.5
VCC_MCU  (via drill 0.35)
  Top 0.21: 35.48,92.03 33.13,94.38 26.97,94.38 M_06.2 | 35.48,92.03 37.12,92.03 37.48,92.39 43.46,92.39 SWITCH_M5.1 | 35.48,92.03 v34.94,91.48 | 28.78,54.34 26.97,54.34 M_04.2 | 28.78,54.34 v28.96,54.16 28.78,54.34 | v37.3,50.35 39.29,52.35 43.46,52.35 SWITCH_M3.1 | v31.86,68.11 31.86,57.42 28.78,54.34 | v3.59,82.61 3.59,92.39 SWITCH_M6.1 | 17.55,32.59 3.59,46.55 3.59,52.35 SWITCH_M4.1 3.41,52.53 1.96,53.98 1.96,64.67 4.68,67.38 4.68,71.73 5.04,72.1 v5.04,73.18 | 17.55,32.59 20.45,29.7 20.81,29.7 30.77,19.73 30.77,15.02 29.87,14.11 26.97,14.11 M_02.2 | v32.95,47.82 17.73,32.59 17.55,32.59 | v32.95,133.89 32.77,134.07 26.97,134.07 M_08.2 | 41.65,132.98 43.28,132.98 43.46,132.8 SWITCH_M7.1 | 41.65,132.98 v33.85,132.98 | 60.85,125.37 60.67,125.19 51.07,125.19 50.34,124.46 45.63,124.46 41.65,128.45 41.65,132.98 | 60.85,125.37 68.28,132.8 68.28,133.52 67.74,134.07 67.19,134.07 M_07.2 | v30.95,136.97 29.51,138.42 28.24,138.42 20.45,146.21 8.67,146.21 2.33,139.87 2.33,137.51 3.41,136.42 3.41,132.8 SWITCH_M8.1 | 65.75,80.43 66.29,79.89 LED1.1-VDD 66.29,79.71 66.29,54.88 66.65,54.52 67.38,54.52 M_03.2 67.56,54.34 67.92,54.34 68.46,53.79 68.46,51.26 70.82,48.9 70.82,16.11 68.83,14.11 68.46,14.11 | 65.75,80.43 65.38,80.79 61.03,80.79 60.67,80.43 57.77,80.43 C3.1 57.59,80.25 56.5,80.25 50.71,74.45 35.48,74.45 35.12,74.81 v28.6,74.81 | 67.92,94.38 67.56,94.38 M_05.2 67.92,94.38 | 67.92,94.38 68.46,93.84 68.46,83.15 65.75,80.43 | 68.46,14.11 67.56,14.11 M_01.2 | 42.55,5.42 61.22,5.42 68.46,12.66 68.46,14.11 | 42.55,5.42 11.57,5.42 5.41,11.58 5.41,12.84 3.59,14.66 3.59,18.1 SWITCH_M2.1
  Top 0.21: v43.64,7.95 43.64,12.12 SWITCH_M1.1 | 42.55,5.42 v42.55,6.86 | v66.11,120.11 60.85,125.37 | v67.01,119.21 67.01,118.48 70.82,114.68 70.82,97.28 67.92,94.38
  Bottom 0.21: v34.94,91.48 34.94,90.4 34.58,90.03 32.77,90.03 CONN02.11 32.77,89.85 32.77,87.14 28.6,82.97 v28.6,74.81 28.6,67.93 29.14,67.38 31.14,67.38 v31.86,68.11 32.95,69.2 32.95,69.92 CONN03.11 | v28.96,54.16 28.96,53.61 31.14,51.44 32.41,51.44 | 32.41,51.44 32.59,51.44 CONN01.11 32.41,51.44 | v37.3,50.35 35.85,48.9 34.04,48.9 33.31,48.18 32.95,48.18 | 32.95,48.18 32.41,48.72 32.41,51.44 | U1.3 3.78,74.81 4.68,74.81 5.04,74.45 v5.04,73.18 4.68,72.82 3.78,72.82 U1.1 3.59,72.82 2.87,72.82 2.14,73.55 2.14,77.71 3.05,78.62 C2.+ 3.05,80.97 3.59,81.52 v3.59,82.61 | v32.95,47.82 32.95,48.18 | v33.85,132.98 v32.95,133.89 32.22,133.89 30.41,135.7 30.41,136.06 30.95,136.6 v30.95,136.97 | v42.55,6.86 v43.64,7.95 | v67.01,119.21 v66.11,120.11
(copper drawn outside any net)
  shapes: Top area x1

### Text on the board
tPlace: OSC
bPlace: SCL | !RST | GND | 3.3V | SDA